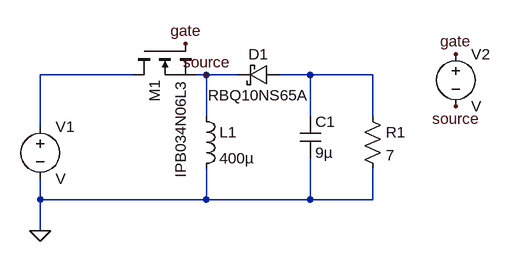
[diagram p0: schematic Power Converter Version 1.1.asc]
Power Converter Version 1.1.asc, the LTspice schematic file:
Version 4
SHEET 1 880 680
WIRE 32 48 -112 48
WIRE 144 48 128 48
WIRE 192 48 144 48
WIRE 304 48 256 48
WIRE 400 48 304 48
WIRE 144 112 144 48
WIRE 304 112 304 48
WIRE 400 112 400 48
WIRE -112 128 -112 48
WIRE -112 240 -112 208
WIRE 144 240 144 192
WIRE 144 240 -112 240
WIRE 304 240 304 176
WIRE 304 240 144 240
WIRE 400 240 400 192
WIRE 400 240 304 240
WIRE -112 288 -112 240
FLAG -112 288 0
FLAG 112 0 gate
FLAG 528 16 gate
FLAG 144 48 source
FLAG 528 96 source
SYMBOL voltage -112 112 R0
SYMATTR InstName V1
SYMBOL voltage 528 0 R0
SYMATTR InstName V2
SYMBOL res 384 96 R0
SYMATTR InstName R1
SYMATTR Value 7
SYMBOL schottky 256 32 R90
WINDOW 0 0 32 VBottom 2
WINDOW 3 32 32 VTop 2
SYMATTR InstName D1
SYMATTR Value RBQ10NS65A
SYMATTR Description Diode
SYMATTR Type diode
SYMBOL ind 128 96 R0
SYMATTR InstName L1
SYMATTR Value 400µ
SYMBOL cap 288 112 R0
SYMATTR InstName C1
SYMATTR Value 9µ
SYMBOL nmos 32 0 M90
SYMATTR InstName M1
SYMATTR Value IPB034N06L3

The netlist it stands for:
* Power Converter Version 1.1.asc
V1 N001 0 V
V2 gate source V
R1 N002 0 7
D1 N002 source RBQ10NS65A
L1 source 0 400µ
C1 N002 0 9µ
M1 N001 gate source source IPB034N06L3
.model D D
.lib standard.dio
.model NMOS NMOS
.model PMOS PMOS
.lib standard.mos
.backanno
.end